# Altium schematic sheet Smartfin Main PCBA Top Level.SchDoc: Top Level
size Letter; TOCFontName: Consolas; TOCFontSize: 24; TOCFontColor: 0; TOCFontAttributes: 0; TOCMaxLinesInTable: 25; TOCVerticalOffset: 200; TOCHorizontalOffset: 500; TOCHorizontalSeparation: 800; TOCVerticalSeparation: 30; TOCHorizTableSize: 640; Engineer: Amy Domino; DocumentNumber: 644-001-023; Revision: A; SheetNumber: 3; SheetTotal: 9; PageSetup: Record=PageOptions|CenterHorizontal=True|CenterVertical=True|PrintScale=0.96|XCorrection=1.00|YCorrection=1.00|PrintKind=0|BorderSize=5000000|LeftOffset=0|BottomOffset=0|Orientation=2|PaperLength=1000|PaperWidth=1000|Scale=100|PaperSource=7|PrintQuality=-4|MediaType=1|DitherType=10|PaperKind=11" x 17"|PrintScaleMode=1
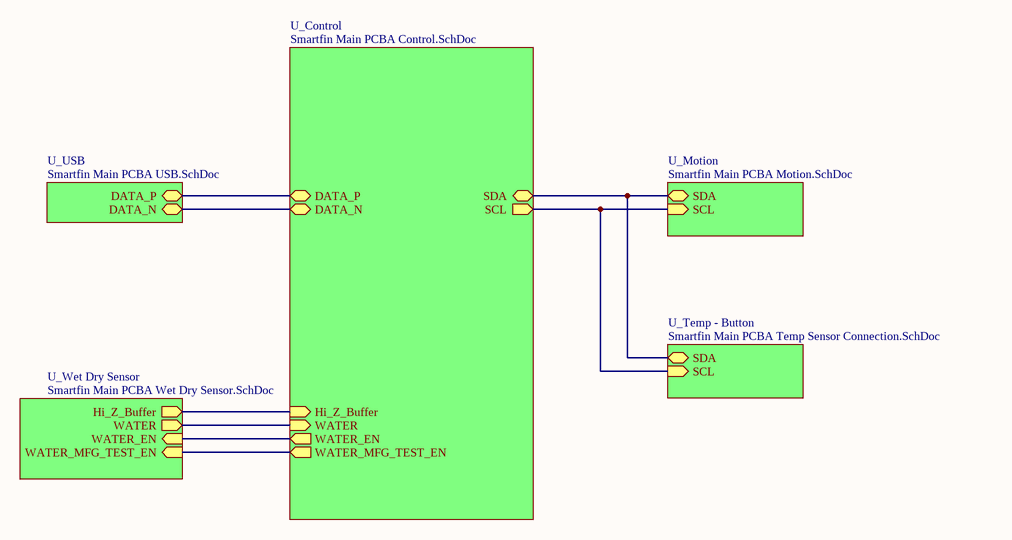
[diagram p0: Smartfin Main PCBA Top Level.SchDoc]

## Sub-sheets
U_Control = Smartfin Main PCBA Control.SchDoc: WATER (in), DATA_N (bidir), DATA_P (bidir), SDA (bidir), SCL (out), WATER_EN (out), Hi_Z_Buffer (in), WATER_MFG_TEST_EN (out)
U_Motion = Smartfin Main PCBA Motion.SchDoc: SDA (bidir), SCL (in)
U_Temp - Button = Smartfin Main PCBA Temp Sensor Connection.SchDoc: SDA (bidir), SCL (in)
U_USB = Smartfin Main PCBA USB.SchDoc: DATA_N (bidir), DATA_P (bidir)
U_Wet Dry Sensor = Smartfin Main PCBA Wet Dry Sensor.SchDoc: WATER (out), WATER_EN (in), Hi_Z_Buffer (out), WATER_MFG_TEST_EN (in)

## Nets
(unnamed): sheet U_Control/WATER, sheet U_Wet Dry Sensor/WATER
(unnamed): sheet U_Control/DATA_N, sheet U_USB/DATA_N
(unnamed): sheet U_Control/DATA_P, sheet U_USB/DATA_P
(unnamed): sheet U_Control/SDA, sheet U_Motion/SDA, sheet U_Temp - Button/SDA
(unnamed): sheet U_Control/SCL, sheet U_Motion/SCL, sheet U_Temp - Button/SCL
(unnamed): sheet U_Control/WATER_EN, sheet U_Wet Dry Sensor/WATER_EN
(unnamed): sheet U_Control/Hi_Z_Buffer, sheet U_Wet Dry Sensor/Hi_Z_Buffer
(unnamed): sheet U_Control/WATER_MFG_TEST_EN, sheet U_Wet Dry Sensor/WATER_MFG_TEST_EN